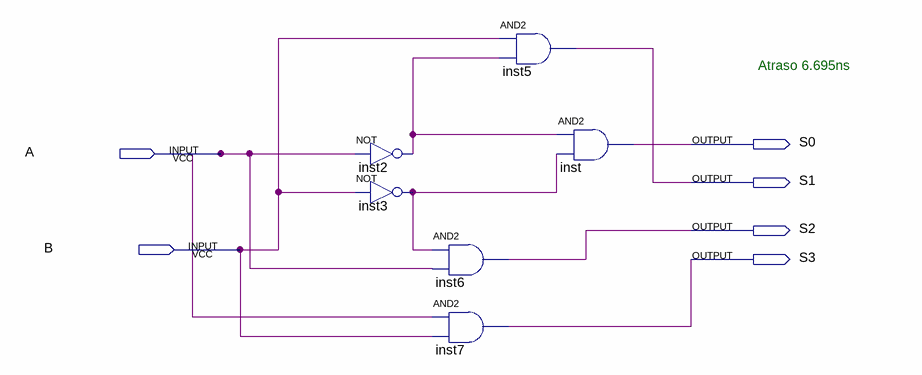
[diagram p0: schematic sheet]
// Quartus schematic DECODER2_4.bdf as structural Verilog: 6 symbols, 6 pins
module DECODER2_4 (
  input  A,
  input  B,
  output S0,
  output S1,
  output S2,
  output S3
);

  wire inst2_out, inst3_out;

  not inst2 (inst2_out, A);
  not inst3 (inst3_out, B);
  and inst6 (S2, inst3_out, A);
  and inst7 (S3, A, B);
  and inst5 (S1, B, inst2_out);
  and inst (S0, inst2_out, inst3_out);

  // Notes on the sheet:
  //   Atraso 6.695ns
endmodule
